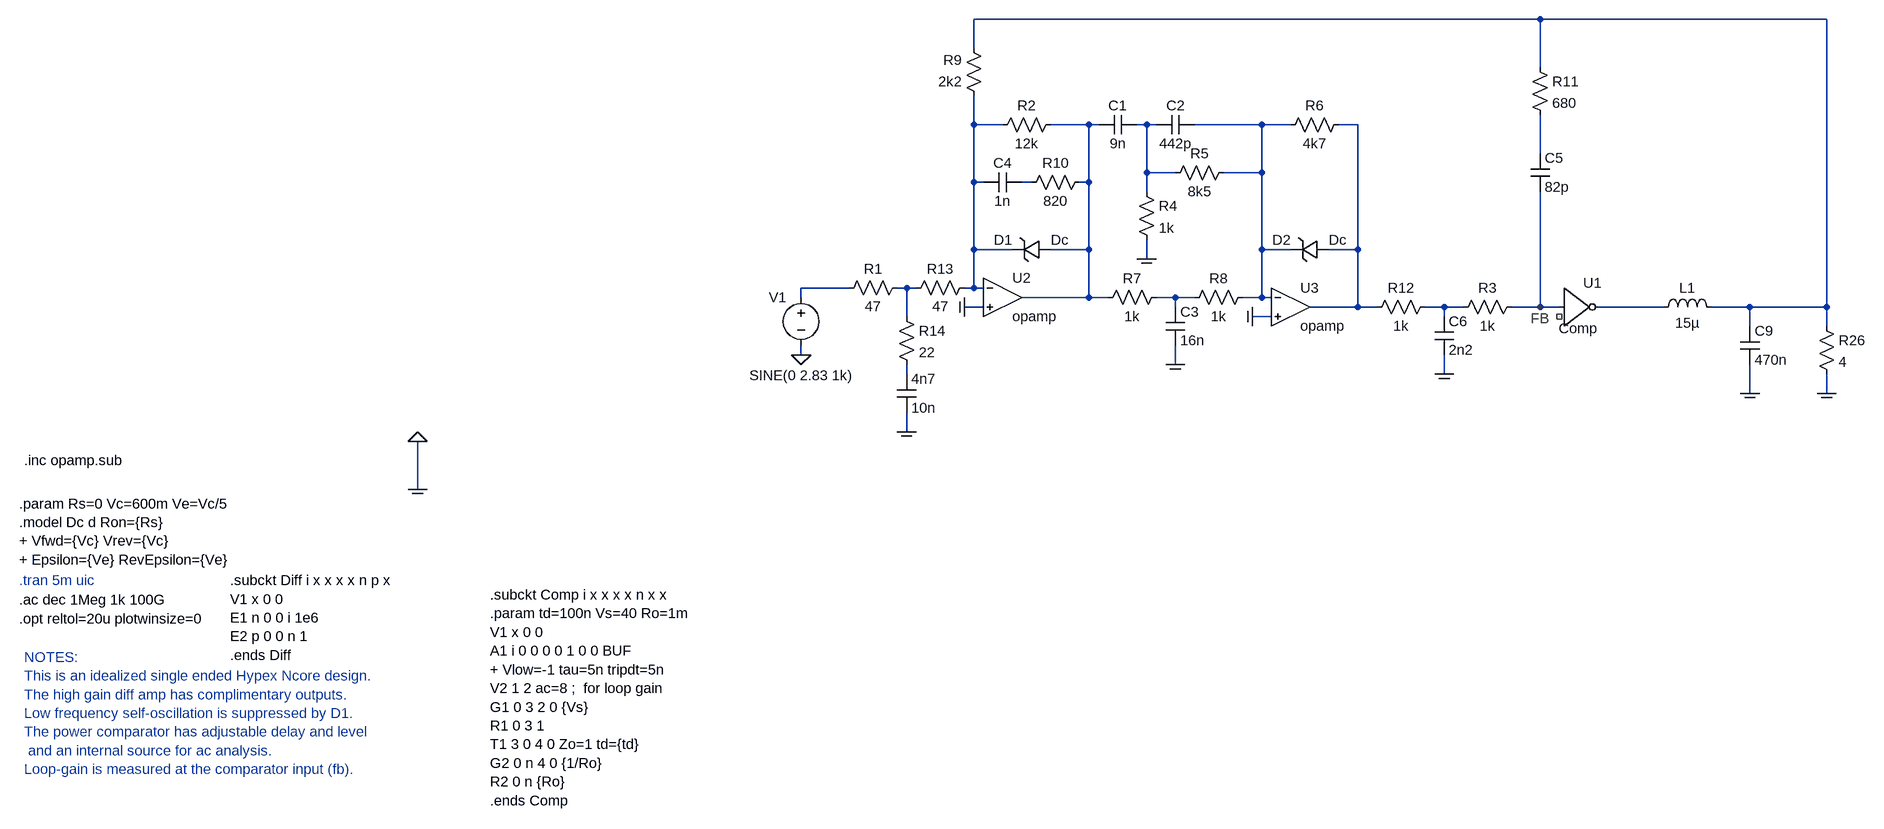
[diagram p0: schematic Class D Simplified.asc]
Class D Simplified.asc, the LTspice schematic file:
Version 4
SHEET 1 3772 1304
WIRE -7520 -2464 -8464 -2464
WIRE -7024 -2464 -7520 -2464
WIRE -8464 -2416 -8464 -2464
WIRE -7520 -2384 -7520 -2464
WIRE -8464 -2288 -8464 -2336
WIRE -8416 -2288 -8464 -2288
WIRE -8272 -2288 -8336 -2288
WIRE -8256 -2288 -8272 -2288
WIRE -8176 -2288 -8192 -2288
WIRE -8160 -2288 -8176 -2288
WIRE -7984 -2288 -8096 -2288
WIRE -7936 -2288 -7984 -2288
WIRE -7824 -2288 -7856 -2288
WIRE -7520 -2240 -7520 -2304
WIRE -8176 -2208 -8176 -2288
WIRE -8128 -2208 -8176 -2208
WIRE -7984 -2208 -7984 -2288
WIRE -7984 -2208 -8048 -2208
WIRE -8464 -2192 -8464 -2288
WIRE -8448 -2192 -8464 -2192
WIRE -8368 -2192 -8384 -2192
WIRE -8272 -2192 -8272 -2288
WIRE -8272 -2192 -8288 -2192
WIRE -8176 -2176 -8176 -2208
WIRE -8464 -2080 -8464 -2192
WIRE -8400 -2080 -8464 -2080
WIRE -8272 -2080 -8272 -2192
WIRE -8272 -2080 -8336 -2080
WIRE -7984 -2080 -7984 -2208
WIRE -7936 -2080 -7984 -2080
WIRE -7824 -2080 -7824 -2288
WIRE -7824 -2080 -7872 -2080
WIRE -8176 -2064 -8176 -2096
WIRE -8672 -2016 -8752 -2016
WIRE -8576 -2016 -8592 -2016
WIRE -8560 -2016 -8576 -2016
WIRE -8464 -2016 -8464 -2080
WIRE -8464 -2016 -8480 -2016
WIRE -8448 -2016 -8464 -2016
WIRE -8752 -2000 -8752 -2016
WIRE -8272 -2000 -8272 -2080
WIRE -8272 -2000 -8384 -2000
WIRE -8240 -2000 -8272 -2000
WIRE -8128 -2000 -8160 -2000
WIRE -8096 -2000 -8128 -2000
WIRE -7984 -2000 -7984 -2080
WIRE -7984 -2000 -8016 -2000
WIRE -7968 -2000 -7984 -2000
WIRE -8448 -1984 -8480 -1984
WIRE -8128 -1984 -8128 -2000
WIRE -7824 -1984 -7824 -2080
WIRE -7824 -1984 -7904 -1984
WIRE -7792 -1984 -7824 -1984
WIRE -7680 -1984 -7712 -1984
WIRE -7648 -1984 -7680 -1984
WIRE -7520 -1984 -7520 -2176
WIRE -7520 -1984 -7568 -1984
WIRE -7488 -1984 -7520 -1984
WIRE -7296 -1984 -7424 -1984
WIRE -7152 -1984 -7216 -1984
WIRE -7024 -1984 -7024 -2464
WIRE -7024 -1984 -7152 -1984
WIRE -8576 -1968 -8576 -2016
WIRE -7968 -1968 -8000 -1968
WIRE -7680 -1968 -7680 -1984
WIRE -7152 -1952 -7152 -1984
WIRE -7024 -1952 -7024 -1984
WIRE -8752 -1904 -8752 -1920
WIRE -8128 -1888 -8128 -1920
WIRE -8576 -1872 -8576 -1888
WIRE -7680 -1872 -7680 -1904
WIRE -7152 -1840 -7152 -1888
WIRE -7024 -1840 -7024 -1872
WIRE -8576 -1776 -8576 -1808
WIRE -10320 -1680 -10320 -1760
FLAG -8752 -1904 0
FLAG -7152 -1840 com
FLAG -7024 -1840 com
FLAG -10320 -1680 com
FLAG -10320 -1760 0
FLAG -8176 -2064 com
FLAG -8128 -1888 COM
FLAG -8480 -1984 com
FLAG -8000 -1968 com
FLAG -7680 -1872 COM
FLAG -8576 -1776 com
FLAG -7520 -1984 FB
SYMBOL voltage -8752 -2016 M0
WINDOW 3 0 131 Top 2
WINDOW 123 0 0 Left 0
WINDOW 39 0 0 Left 0
SYMATTR Value SINE(0 2.83 1k)
SYMATTR InstName V1
SYMBOL ind -7312 -1968 R270
WINDOW 0 32 56 VTop 2
WINDOW 3 5 56 VBottom 2
SYMATTR InstName L1
SYMATTR Value 15µ
SYMBOL Res -7040 -1968 R0
SYMATTR InstName R26
SYMATTR Value 4
SYMBOL Digital/inv -7488 -2048 R0
WINDOW 3 -1 100 Left 2
SYMATTR Value Comp
SYMATTR InstName U1
SYMATTR Prefix X
SYMATTR SpiceModel ""
SYMATTR Value2 Td=130n Vs=72
SYMBOL Cap -7168 -1952 R0
SYMATTR InstName C9
SYMATTR Value 470n
SYMBOL res -8576 -2032 R90
WINDOW 0 0 56 VBottom 2
WINDOW 3 32 56 VTop 2
SYMATTR InstName R1
SYMATTR Value 47
SYMBOL OpAmps\\opamp -8416 -2064 R0
SYMATTR InstName U2
SYMBOL res -8320 -2304 R90
WINDOW 0 0 56 VBottom 2
WINDOW 3 32 56 VTop 2
SYMATTR InstName R2
SYMATTR Value 12k
SYMBOL cap -8192 -2304 R90
WINDOW 0 0 32 VBottom 2
WINDOW 3 32 32 VTop 2
SYMATTR InstName C1
SYMATTR Value 9n
SYMBOL cap -8096 -2304 R90
WINDOW 0 0 32 VBottom 2
WINDOW 3 32 32 VTop 2
SYMATTR InstName C2
SYMATTR Value 442p
SYMBOL res -8192 -2192 R0
SYMATTR InstName R4
SYMATTR Value 1k
SYMBOL res -8032 -2224 R90
WINDOW 0 0 56 VBottom 2
WINDOW 3 32 56 VTop 2
SYMATTR InstName R5
SYMATTR Value 8k5
SYMBOL res -7840 -2304 R90
WINDOW 0 0 56 VBottom 2
WINDOW 3 32 56 VTop 2
SYMATTR InstName R6
SYMATTR Value 4k7
SYMBOL res -8144 -2016 R90
WINDOW 0 0 56 VBottom 2
WINDOW 3 32 56 VTop 2
SYMATTR InstName R7
SYMATTR Value 1k
SYMBOL res -8000 -2016 R90
WINDOW 0 0 56 VBottom 2
WINDOW 3 32 56 VTop 2
SYMATTR InstName R8
SYMATTR Value 1k
SYMBOL cap -8144 -1984 R0
SYMATTR InstName C3
SYMATTR Value 16n
SYMBOL OpAmps\\opamp -7936 -2048 R0
SYMATTR InstName U3
SYMBOL res -8448 -2320 R180
WINDOW 0 36 76 Left 2
WINDOW 3 36 40 Left 2
SYMATTR InstName R9
SYMATTR Value 2k2
SYMBOL cap -8384 -2208 R90
WINDOW 0 0 32 VBottom 2
WINDOW 3 32 32 VTop 2
SYMATTR InstName C4
SYMATTR Value 1n
SYMBOL res -8272 -2208 R90
WINDOW 0 0 56 VBottom 2
WINDOW 3 32 56 VTop 2
SYMATTR InstName R10
SYMATTR Value 820
SYMBOL cap -7536 -2240 R0
SYMATTR InstName C5
SYMATTR Value 82p
SYMBOL res -7536 -2400 R0
SYMATTR InstName R11
SYMATTR Value 680
SYMBOL res -7696 -2000 R90
WINDOW 0 0 56 VBottom 2
WINDOW 3 32 56 VTop 2
SYMATTR InstName R12
SYMATTR Value 1k
SYMBOL cap -7696 -1968 R0
SYMATTR InstName C6
SYMATTR Value 2n2
SYMBOL res -7552 -2000 R90
WINDOW 0 0 56 VBottom 2
WINDOW 3 32 56 VTop 2
SYMATTR InstName R3
SYMATTR Value 1k
SYMBOL TVSdiode -7872 -2096 R90
WINDOW 0 0 64 VRight 2
WINDOW 3 0 0 VLeft 2
SYMATTR InstName D2
SYMATTR Value Dc
SYMBOL TVSdiode -8336 -2096 R90
WINDOW 0 0 64 VRight 2
WINDOW 3 0 0 VLeft 2
SYMATTR InstName D1
SYMATTR Value Dc
SYMBOL res -8464 -2032 R90
WINDOW 0 0 56 VBottom 2
WINDOW 3 32 56 VTop 2
SYMATTR InstName R13
SYMATTR Value 47
SYMBOL res -8592 -1984 R0
SYMATTR InstName R14
SYMATTR Value 22
SYMBOL cap -8592 -1872 R0
SYMATTR InstName 4n7
SYMATTR Value 10n
TEXT -10984 -1496 Left 2 !.ac dec 1Meg 1k 100G
TEXT -10016 -1504 Left 2 !.subckt Comp i x x x x n x x\n.param td=100n Vs=40 Ro=1m\nV1 x 0 0\nA1 i 0 0 0 0 1 0 0 BUF\n+ Vlow=-1 tau=5n tripdt=5n\nV2 1 2 ac=8 ;  for loop gain\nG1 0 3 2 0 {Vs}\nR1 0 3 1\nT1 3 0 4 0 Zo=1 td={td}\nG2 0 n 4 0 {1/Ro}\nR2 0 n {Ro}\n.ends Comp
TEXT -10984 -1528 Left 2 ;.tran 5m uic
TEXT -10984 -1464 Left 2 !.opt reltol=20u plotwinsize=0
TEXT -10984 -1656 Left 2 !.param Rs=0 Vc=600m Ve=Vc/5\n.model Dc d Ron={Rs}\n+ Vfwd={Vc} Vrev={Vc}\n+ Epsilon={Ve} RevEpsilon={Ve}
TEXT -10632 -1528 Left 2 !.subckt Diff i x x x x n p x\nV1 x 0 0\nE1 n 0 0 i 1e6\nE2 p 0 0 n 1\n.ends Diff
TEXT -10976 -1400 Left 2 ;NOTES:\nThis is an idealized single ended Hypex Ncore design.\nThe high gain diff amp has complimentary outputs.\nLow frequency self-oscillation is suppressed by D1.\nThe power comparator has adjustable delay and level\n and an internal source for ac analysis.\nLoop-gain is measured at the comparator input (fb).
TEXT -10976 -1728 Left 2 !.inc opamp.sub

The netlist it stands for:
* Class D Simplified.asc
V1 N009 0 SINE(0 2.83 1k)
L1 N013 N001 15µ
R26 N001 0 4
XU1 FB N013 NC_01 Comp Td=130n Vs=72  ; pins in _Q com
C9 N001 0 470n
R1 N010 N009 47
XU2 N002 0 N003 opamp Aol=100K GBW=10Meg  ; pins invin noninvin out
R2 N003 N002 12k
C1 N004 N003 9n
C2 N005 N004 442p
R4 N004 0 1k
R5 N005 N004 8k5
R6 N006 N005 4k7
R7 N011 N003 1k
R8 N005 N011 1k
C3 N011 0 16n
XU3 N005 0 N006 opamp Aol=100K GBW=10Meg  ; pins invin noninvin out
R9 N002 N001 2k2
C4 N008 N002 1n
R10 N003 N008 820
C5 N007 FB 82p
R11 N001 N007 680
R12 N012 N006 1k
C6 N012 0 2n2
R3 FB N012 1k
D2 N006 N005 Dc
D1 N003 N002 Dc
R13 N002 N010 47
R14 N010 N014 22
C§4n7 N014 0 10n
.model D D
.lib standard.dio
.ac dec 1Meg 1k 100G
.subckt Comp i x x x x n x x
.param td=100n Vs=40 Ro=1m
V1 x 0 0
A1 i 0 0 0 0 1 0 0 BUF
+ Vlow=-1 tau=5n tripdt=5n
V2 1 2 ac=8 ;  for loop gain
G1 0 3 2 0 {Vs}
R1 0 3 1
T1 3 0 4 0 Zo=1 td={td}
G2 0 n 4 0 {1/Ro}
R2 0 n {Ro}
.ends Comp
* .tran 5m uic
.opt reltol=20u plotwinsize=0
.param Rs=0 Vc=600m Ve=Vc/5
.model Dc d Ron={Rs}
+ Vfwd={Vc} Vrev={Vc}
+ Epsilon={Ve} RevEpsilon={Ve}
.subckt Diff i x x x x n p x
V1 x 0 0
E1 n 0 0 i 1e6
E2 p 0 0 n 1
.ends Diff
* NOTES:
* This is an idealized single ended Hypex Ncore design.
* The high gain diff amp has complimentary outputs.
* Low frequency self-oscillation is suppressed by D1.
* The power comparator has adjustable delay and level
*  and an internal source for ac analysis.
* Loop-gain is measured at the comparator input (fb).
.inc opamp.sub
.backanno
.end